# EAGLE design B163D (EAGLE 6.6.0)
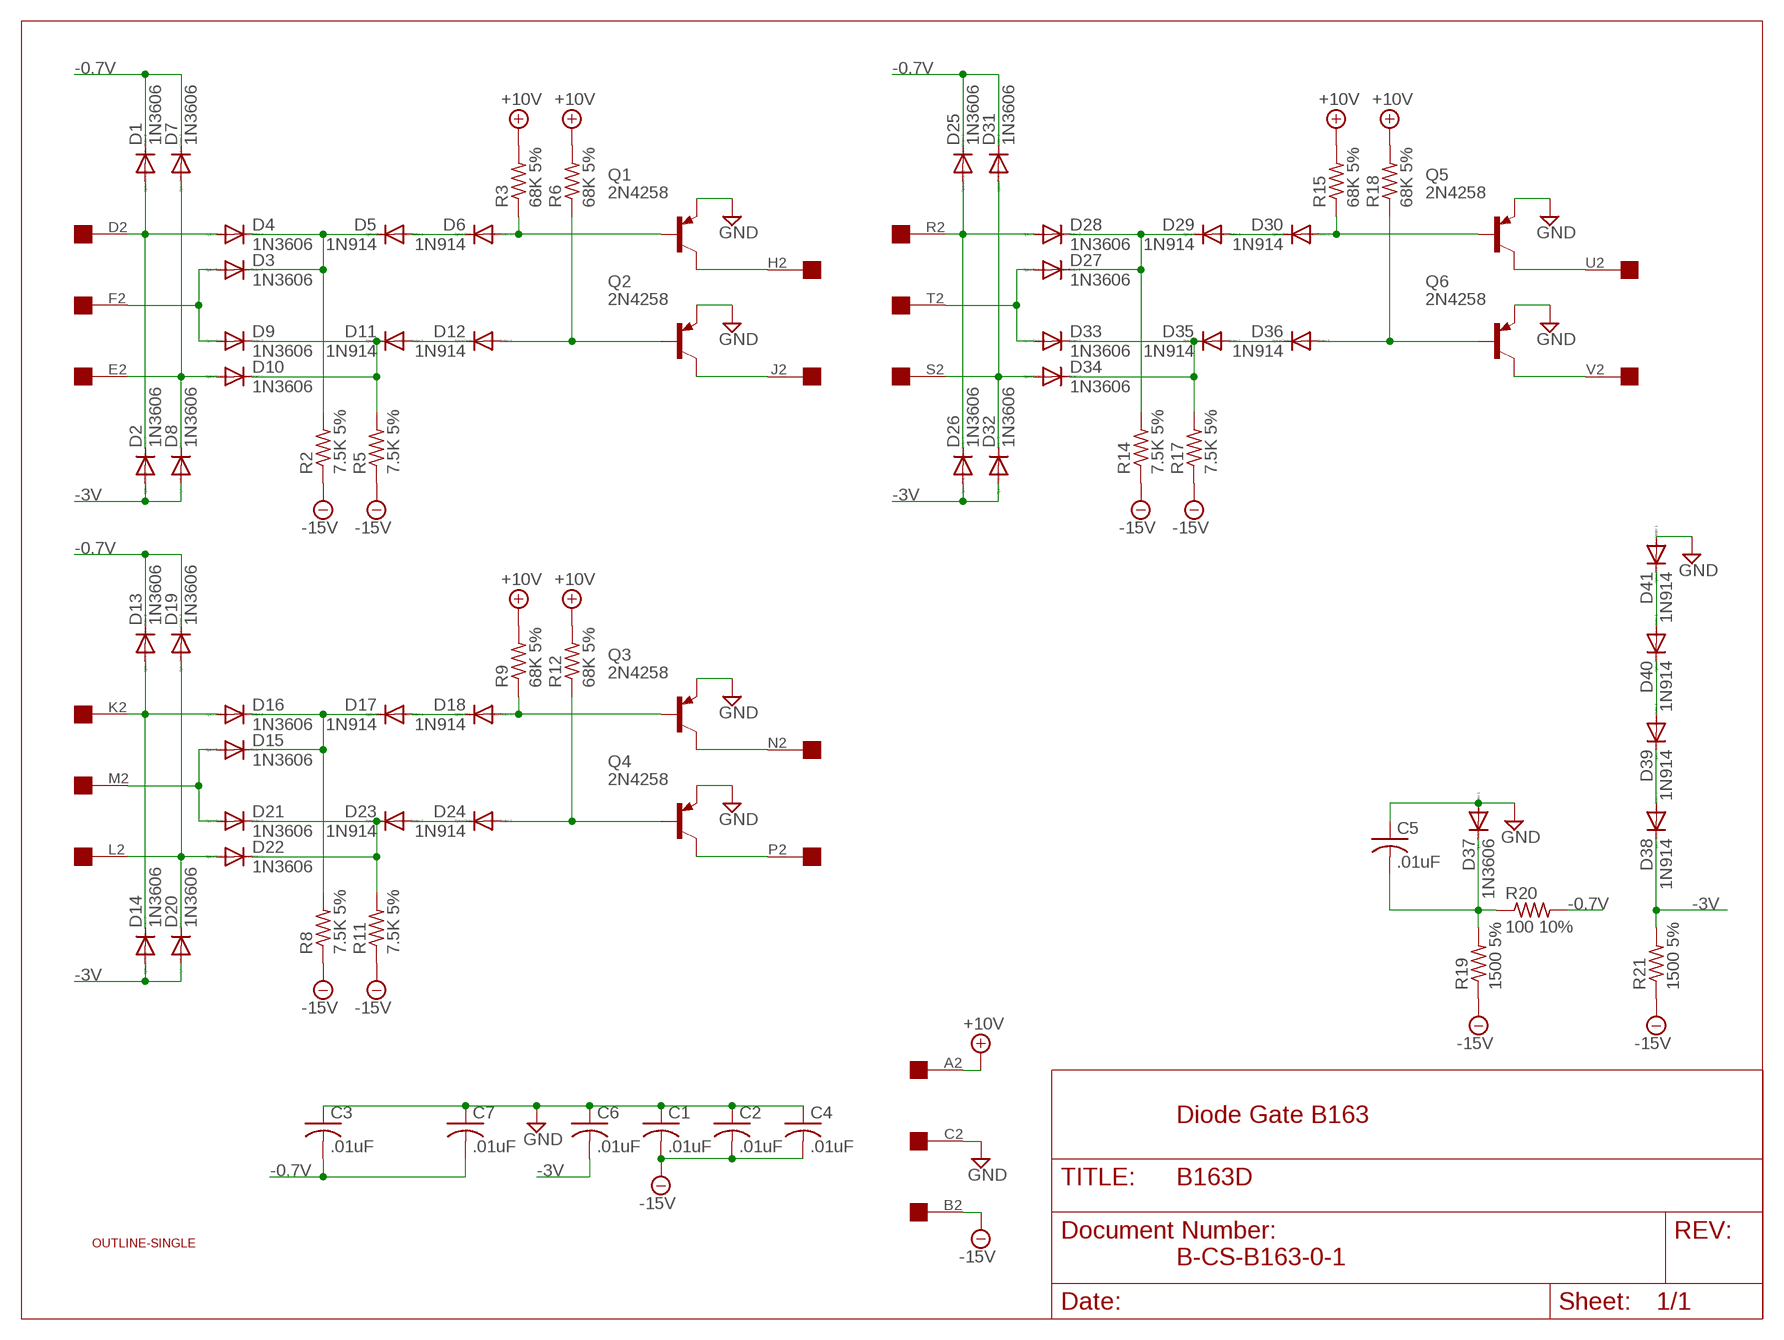
[diagram p0: schematic, sheet 1]

## Parts
C1  .01uF  C-US050-025X075  [C050-025X075]
C2  .01uF  C-US050-025X075  [C050-025X075]
C3  .01uF  C-US050-025X075  [C050-025X075]
C4  .01uF  C-US050-025X075  [C050-025X075]
C5  .01uF  C-US050-025X075  [C050-025X075]
C6  .01uF  C-US050-025X075  [C050-025X075]
C7  .01uF  C-US050-025X075  [C050-025X075]
D1  1N3606  1N4148DO35-10  [DO35-10]
D2  1N3606  1N4148DO35-10  [DO35-10]
D3  1N3606  1N4148DO35-10  [DO35-10]
D4  1N3606  1N4148DO35-10  [DO35-10]
D5  1N914  1N4148DO35-10  [DO35-10]
D6  1N914  1N4148DO35-10  [DO35-10]
D7  1N3606  1N4148DO35-10  [DO35-10]
D8  1N3606  1N4148DO35-10  [DO35-10]
D9  1N3606  1N4148DO35-10  [DO35-10]
D10  1N3606  1N4148DO35-10  [DO35-10]
D11  1N914  1N4148DO35-10  [DO35-10]
D12  1N914  1N4148DO35-10  [DO35-10]
D13  1N3606  1N4148DO35-10  [DO35-10]
D14  1N3606  1N4148DO35-10  [DO35-10]
D15  1N3606  1N4148DO35-10  [DO35-10]
D16  1N3606  1N4148DO35-10  [DO35-10]
D17  1N914  1N4148DO35-10  [DO35-10]
D18  1N914  1N4148DO35-10  [DO35-10]
D19  1N3606  1N4148DO35-10  [DO35-10]
D20  1N3606  1N4148DO35-10  [DO35-10]
D21  1N3606  1N4148DO35-10  [DO35-10]
D22  1N3606  1N4148DO35-10  [DO35-10]
D23  1N914  1N4148DO35-10  [DO35-10]
D24  1N914  1N4148DO35-10  [DO35-10]
D25  1N3606  1N4148DO35-10  [DO35-10]
D26  1N3606  1N4148DO35-10  [DO35-10]
D27  1N3606  1N4148DO35-10  [DO35-10]
D28  1N3606  1N4148DO35-10  [DO35-10]
D29  1N914  1N4148DO35-10  [DO35-10]
D30  1N914  1N4148DO35-10  [DO35-10]
D31  1N3606  1N4148DO35-10  [DO35-10]
D32  1N3606  1N4148DO35-10  [DO35-10]
D33  1N3606  1N4148DO35-10  [DO35-10]
D34  1N3606  1N4148DO35-10  [DO35-10]
D35  1N914  1N4148DO35-10  [DO35-10]
D36  1N914  1N4148DO35-10  [DO35-10]
D37  1N3606  1N4148DO35-10  [DO35-10]
D38  1N914  1N4148DO35-10  [DO35-10]
D39  1N914  1N4148DO35-10  [DO35-10]
D40  1N914  1N4148DO35-10  [DO35-10]
D41  1N914  1N4148DO35-10  [DO35-10]
Q1  2N4258  2N2904  [TO39]
Q2  2N4258  2N2904  [TO39]
Q3  2N4258  2N2904  [TO39]
Q4  2N4258  2N2904  [TO39]
Q5  2N4258  2N2904  [TO39]
Q6  2N4258  2N2904  [TO39]
R2  7.5K 5%  R-US_0207/10  [0207/10]
R3  68K 5%  R-US_0207/10  [0207/10]
R5  7.5K 5%  R-US_0207/10  [0207/10]
R6  68K 5%  R-US_0207/10  [0207/10]
R8  7.5K 5%  R-US_0207/10  [0207/10]
R9  68K 5%  R-US_0207/10  [0207/10]
R11  7.5K 5%  R-US_0207/10  [0207/10]
R12  68K 5%  R-US_0207/10  [0207/10]
R14  7.5K 5%  R-US_0207/10  [0207/10]
R15  68K 5%  R-US_0207/10  [0207/10]
R17  7.5K 5%  R-US_0207/10  [0207/10]
R18  68K 5%  R-US_0207/10  [0207/10]
R19  1500 5%  R-US_0207/10  [0207/10]
R20  100 10%  R-US_0207/10  [0207/10]
R21  1500 5%  R-US_0207/10  [0207/10]
U$1  OUTLINE-SINGLE  [SINGLE]
U$2  EDGE-1  [EDGE-CON1]

## Nets
+10V: R3.2 R6.2 R9.2 R12.2 R15.2 R18.2 U$2.A2
-0.7V: C3.2 C7.2 D1.C D7.C D13.C D19.C D25.C D31.C R20.2
-3V [Supply]: C6.2 D2.A D8.A D14.A D20.A D26.A D32.A D38.C R21.2
-15V: C1.2 C2.2 C4.2 R2.1 R5.1 R8.1 R11.1 R14.1 R17.1 R19.1 R21.1 U$2.B2
GND [Supply]: C1.1 C2.1 C3.1 C4.1 C5.1 C6.1 C7.1 D37.A D41.A Q1.1(E) Q2.1(E) Q3.1(E) Q4.1(E) Q5.1(E) Q6.1(E) U$2.C2
N$1: D7.A D8.C D10.A U$2.E2
N$2: D3.A D9.A U$2.F2
N$3: D6.A Q1.2(B) R3.1
N$4: D9.C D10.C D11.C R5.2
N$5: D3.C D4.C D5.C R2.2
N$6: D11.A D12.C
N$7: D12.A Q2.2(B) R6.1
N$8: Q2.3(C) U$2.J2
N$9: D15.C D16.C D17.C R8.2
N$10: D1.A D2.C D4.A U$2.D2
N$11: Q1.3(C) U$2.H2
N$12: D15.A D21.A U$2.M2
N$13: D13.A D14.C D16.A U$2.K2
N$14: D17.A D18.C
N$15: D5.A D6.C
N$16: D18.A Q3.2(B) R9.1
N$17: Q3.3(C) U$2.N2
N$18: D19.A D20.C D22.A U$2.L2
N$19: D21.C D22.C D23.C R11.2
N$20: D23.A D24.C
N$21: D24.A Q4.2(B) R12.1
N$22: Q4.3(C) U$2.P2
N$23: D27.C D28.C D29.C R14.2
N$24: D27.A D33.A U$2.T2
N$25: D25.A D26.C D28.A U$2.R2
N$26: D40.A D41.C
N$27: D39.A D40.C
N$28: D29.A D30.C
N$29: D38.A D39.C
N$30: D30.A Q5.2(B) R15.1
N$31: Q5.3(C) U$2.U2
N$32: D31.A D32.C D34.A U$2.S2
N$33: D33.C D34.C D35.C R17.2
N$34: D35.A D36.C
N$35: D36.A Q6.2(B) R18.1
N$36: Q6.3(C) U$2.V2
N$37: C5.2 D37.C R19.2 R20.1

## Notes on the sheet
- Diode Gate B163
- B-CS-B163-0-1

## Library data of the parts
C1-C7 = rcl:C-US: CAPACITOR, American symbol
D1-D41 = diode:1N4148: DIODE high speed (Philips)
Q1-Q6 = transistor-pnp:2N2904*: PNP Transistror
R2 R3 R5 R6 R8 R9 R11 R12 R14 R15 R17-R21 = rcl:R-US_: RESISTOR, American symbol
U$1 = dec-con:OUTLINE-*: Board outlines for DEC boards.
U$2 = dec-con:EDGE-1: Single-Sided DEC Edge Connector -- (side 2)

## Net classes
1 Supply: width 0.813 mm

## Board
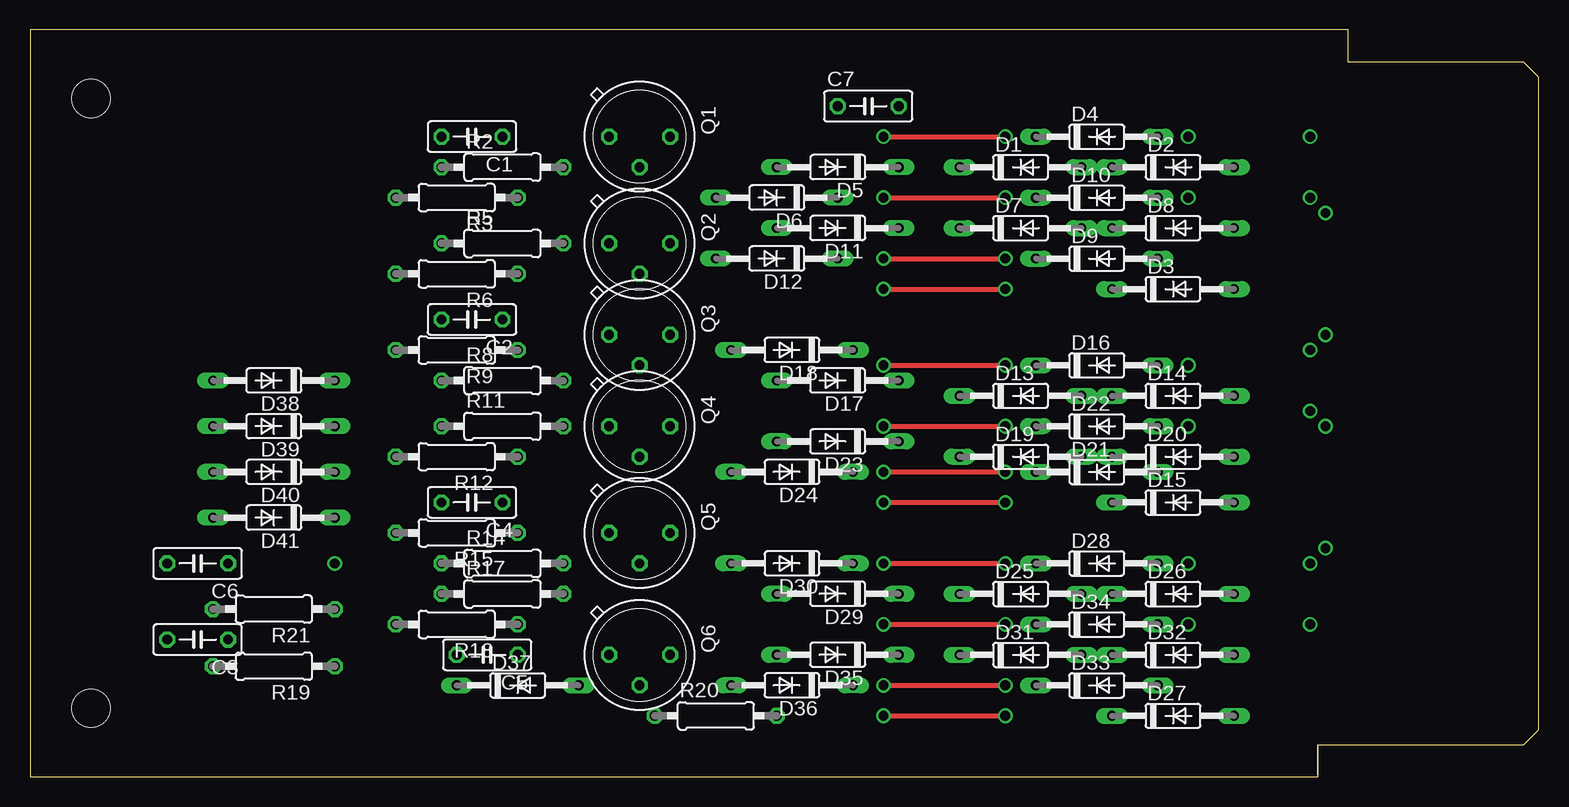
[diagram p1: board, top side]
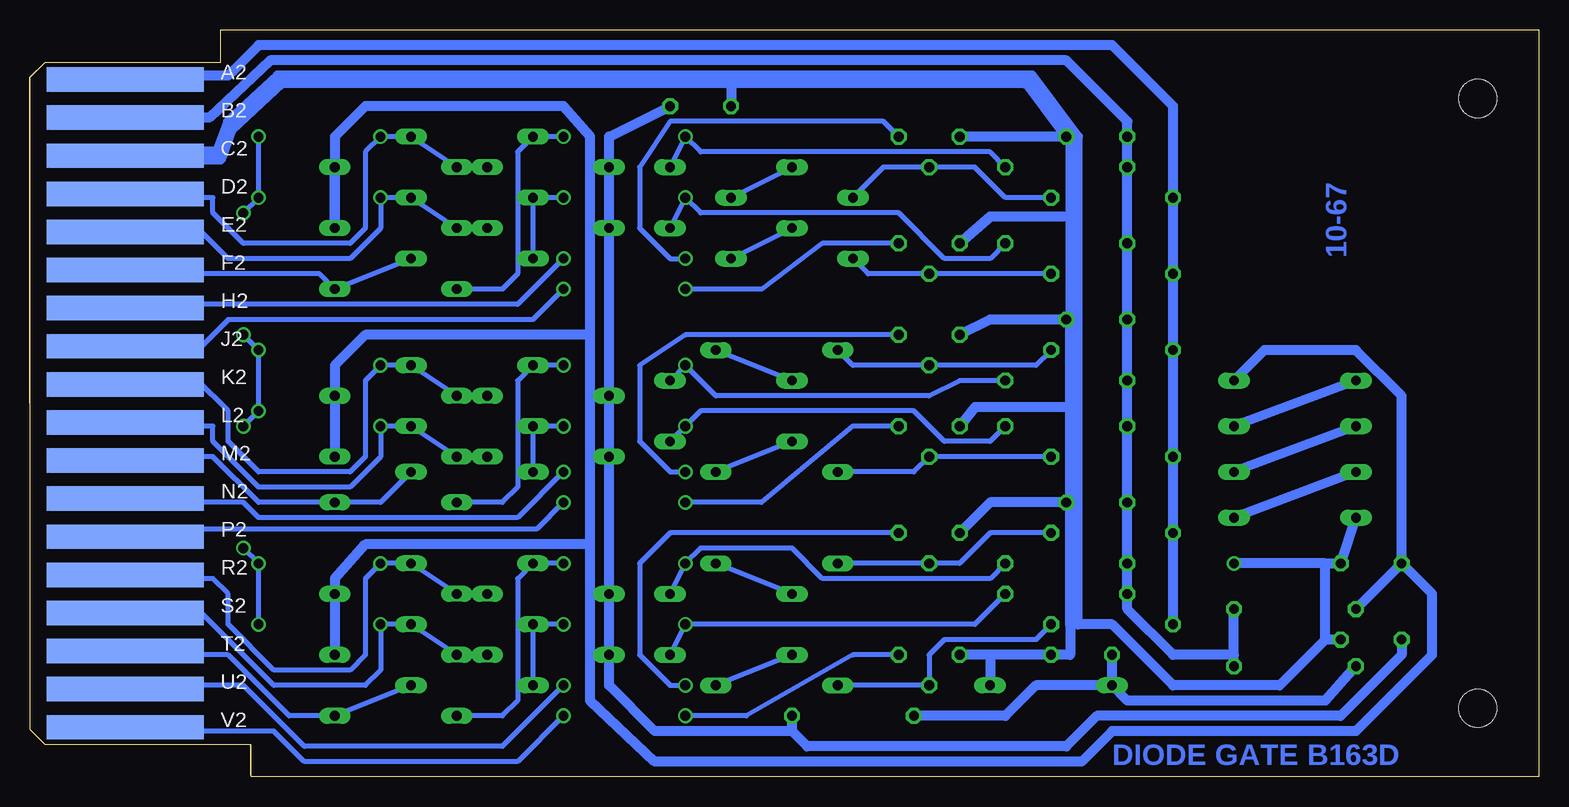
[diagram p2: board, bottom side, seen from below]

Size 125.73 x 62.23 mm. Coordinates in mm from the lower left corner, seen from the top.
Copper layers (1+16): Top 0.035mm / dielectric 1.5mm / Bottom 0.035mm
Design rules "16mils": minimum track width 16mil, minimum drill 32mil, track to track 15mil, track to pad 10mil, pad to pad 10mil, via to via 10mil, smd to smd 10mil, copper to edge 13mil, drill to drill 10mil, minimum pad ring 10mil, minimum via ring 8mil, stop-mask expansion 0mil, vias tented up to drill 0mil, thermal gap 10mil

### Footprints (pad centres in the part's own frame; a part is rotated, then mirrored left to right if it is on the bottom)
C050-025X075 = drill 0.813 octagon: 1 -2.54,0; 2 2.54,0
DO35-10 = drill 0.813 long: A 5.08,0; C -5.08,0
TO39 = drill 0.813 octagon: 1 0,-2.54; 2 2.54,0; 3 0,2.54
0207/10 = drill 0.813 octagon: 1 -5.08,0; 2 5.08,0
SINGLE = hole 3.175: 120.65,56.515; 120.65,5.715
EDGE-CON1 = smd 13.106 x 2.032 bottom: A2 7.938,4.128; B2 7.938,7.303; C2 7.938,10.477; D2 7.938,13.652; E2 7.938,16.828; F2 7.938,20.003; H2 7.938,23.177; J2 7.938,26.352; K2 7.938,29.527; L2 7.938,32.703; M2 7.938,35.877; N2 7.938,39.053; P2 7.938,42.227; R2 7.938,45.403; S2 7.938,48.578; T2 7.938,51.752; U2 7.938,54.928; V2 7.938,58.102

### Placement (x,y rotation side)
C1  36.83,53.34 180 top
C2  36.83,38.1 180 top
C3  13.97,11.43 180 top
C4  36.83,22.86 180 top
C5  38.1,10.16 180 top
C6  13.97,17.78 180 top
C7  69.85,55.88 0 top
D1  82.55,50.8 0 top
D2  95.25,50.8 0 top
D3  95.25,40.64 0 top
D4  88.9,53.34 0 top
D5  67.31,50.8 180 top
D6  62.23,48.26 180 top
D7  82.55,45.72 0 top
D8  95.25,45.72 0 top
D9  88.9,43.18 0 top
D10  88.9,48.26 0 top
D11  67.31,45.72 180 top
D12  62.23,43.18 180 top
D13  82.55,31.75 0 top
D14  95.25,31.75 0 top
D15  95.25,22.86 0 top
D16  88.9,34.29 0 top
D17  67.31,33.02 180 top
D18  63.5,35.56 180 top
D19  82.55,26.67 0 top
D20  95.25,26.67 0 top
D21  88.9,25.4 0 top
D22  88.9,29.21 0 top
D23  67.31,27.94 180 top
D24  63.5,25.4 180 top
D25  82.55,15.24 0 top
D26  95.25,15.24 0 top
D27  95.25,5.08 0 top
D28  88.9,17.78 0 top
D29  67.31,15.24 180 top
D30  63.5,17.78 180 top
D31  82.55,10.16 0 top
D32  95.25,10.16 0 top
D33  88.9,7.62 0 top
D34  88.9,12.7 0 top
D35  67.31,10.16 180 top
D36  63.5,7.62 180 top
D37  40.64,7.62 0 top
D38  20.32,33.02 180 top
D39  20.32,29.21 180 top
D40  20.32,25.4 180 top
D41  20.32,21.59 180 top
Q1  50.8,53.34 270 top
Q2  50.8,44.45 270 top
Q3  50.8,36.83 270 top
Q4  50.8,29.21 270 top
Q5  50.8,20.32 270 top
Q6  50.8,10.16 270 top
R2  39.37,50.8 0 top
R3  35.56,48.26 180 top
R5  39.37,44.45 0 top
R6  35.56,41.91 180 top
R8  39.37,33.02 0 top
R9  35.56,35.56 180 top
R11  39.37,29.21 0 top
R12  35.56,26.67 180 top
R14  39.37,17.78 0 top
R15  35.56,20.32 180 top
R17  39.37,15.24 0 top
R18  35.56,12.7 180 top
R19  20.32,9.21 180 top
R20  57.15,5.08 0 top
R21  20.32,13.97 180 top
U$1  125.73,62.23 180 top
U$2  125.73,62.23 180 top

### Tracks (layer width: path | path; a pad name or v marks a point on that pad's centre or on a via)
+10V
  Bottom 0.813: U$2.A2 116.84,58.42 109.22,58.42 106.68,60.96 35.56,60.96 30.48,55.88 R3.2 R6.2 R9.2 R12.2 R15.2 R18.2
-0.7V
  Bottom 0.813: C7.2 77.47,53.34 D1.C D7.C D13.C D19.C D25.C D31.C 77.47,7.62 73.66,3.81 62.23,3.81 | C3.2 11.43,10.16 16.51,5.08 36.83,5.08 39.37,2.54 60.96,2.54 62.23,3.81 | 62.23,3.81 R20.2
-3V
  Bottom 0.813: D38.C 22.86,35.56 15.24,35.56 11.43,31.75 C6.2 | C6.2 R21.2 | C6.2 8.89,15.24 8.89,10.16 15.24,3.81 35.56,3.81 38.1,1.27 73.66,1.27 79.06,6.35 79.06,19.37 | D2.A D8.A 100.33,53.34 97.79,55.88 81.28,55.88 79.06,53.34 79.06,36.83 | 79.06,36.83 97.79,36.83 100.33,34.29 D14.A D20.A | D32.A D26.A 100.33,16.51 97.79,19.37 79.06,19.37 | 79.06,19.37 79.06,36.83
-15V
  Bottom 0.813: U$2.B2 117.16,54.93 110.81,54.93 105.73,59.69 39.37,59.69 34.29,54.61 C1.2 R2.1 R5.1 C2.2 R8.1 R11.1 C4.2 R14.1 R17.1 34.29,13.97 30.48,10.16 25.4,10.16 | R19.1 25.4,10.16 | 25.4,10.16 R21.1
GND  (via drill 0.81)
  Bottom 0.813: U$2.C2 116.84,52.07 110.17,52.07 | 109.86,51.44 110.17,52.07 | 104.78,57.78 104.14,58.42 | 104.78,57.78 108.9,53.98 109.86,51.44 | 43.18,58.42 67.31,58.42 | 67.31,58.42 104.14,58.42 | 43.18,58.42 C1.1 | C1.1 Q1.1 | 67.31,58.42 C7.1 | C2.1 39.05,38.42 39.05,46.67 | 39.05,46.67 39.05,53.34 C1.1 | C4.1 39.05,23.18 39.05,30.8 | 39.05,30.8 39.05,38.1 C2.1 | 39.05,12.7 39.05,10.16 C5.1 45.72,10.16 | 39.05,12.7 39.05,22.86 C4.1 | 45.72,10.16 D37.A | Q5.1 45.72,22.86 C4.1 | Q4.1 46.99,30.8 39.05,30.8 | Q3.1 45.72,38.1 C2.1 | Q2.1 45.72,46.67 39.05,46.67 | D41.A C6.1 17.78,17.78 | 17.78,17.78 v25.4,17.78 | C3.1 17.78,11.43 | 17.78,11.43 17.78,17.78 | 45.72,10.16 Q6.1 | 38.42,12.7 35.56,12.7 30.48,7.62 21.59,7.62 17.78,11.43 | 38.42,12.7 39.05,12.7 | 43.18,58.42 42.23,58.42 38.42,53.34 38.42,12.7 | 43.18,58.42 42.86,57.78 104.78,57.78 | 104.14,58.42 105.09,58.42 109.22,54.61 110.17,52.07 | 118.11,52.07 116.84,51.44 109.86,51.44
N$1  (via drill 0.81)
  Bottom 0.406: D7.A D8.C D10.A v96.52,48.26 96.52,45.72 99.06,43.18 109.22,43.18 111.76,45.72 116.84,45.72 U$2.E2
N$2
  Bottom 0.406: U$2.F2 116.84,41.91 101.6,41.91 D3.A D9.A
N$3
  Bottom 0.406: D6.A 54.61,50.8 Q1.2 46.99,50.8 44.45,48.26 R3.1
N$4  (via drill 0.81)
  Top 0.406: v71.12,48.26 v81.28,48.26
  Bottom 0.406: D11.C v71.12,48.26 69.85,46.99 53.34,46.99 49.53,43.18 45.72,43.18 R5.2 | v81.28,48.26 D10.C D9.C
N$5  (via drill 0.81)
  Top 0.406: v71.12,53.34 v81.28,53.34
  Bottom 0.406: R2.2 45.72,52.07 69.85,52.07 v71.12,53.34 D5.C | v81.28,53.34 D4.C 85.09,52.07 85.09,41.91 86.36,40.64 D3.C
N$6
  Bottom 0.406: D11.A D12.C
N$7
  Bottom 0.406: R6.1 Q2.2 55.88,41.91 D12.A
N$8  (via drill 0.81)
  Top 0.406: v71.12,40.64 v81.28,40.64
  Bottom 0.406: Q2.3 59.69,44.45 64.77,40.64 v71.12,40.64 | U$2.J2 116.84,35.56 111.76,35.56 109.22,38.1 83.82,38.1 v81.28,40.64
N$9  (via drill 0.81)
  Top 0.406: v71.12,34.29 v81.28,34.29
  Bottom 0.406: D17.C v71.12,34.29 68.58,31.75 50.8,31.75 48.26,33.02 R8.2 | v81.28,34.29 D16.C 85.09,33.02 85.09,24.13 86.36,22.86 D15.C
N$10  (via drill 0.81)
  Bottom 0.406: D1.A D2.C D4.A v96.52,53.34 97.79,52.07 97.79,45.72 99.06,44.45 107.95,44.45 110.49,46.99 110.49,48.26 116.84,48.26 U$2.D2
N$11  (via drill 0.81)
  Top 0.406: v71.12,43.18 v81.28,43.18
  Bottom 0.406: Q1.3 54.61,54.61 72.39,54.61 74.93,50.8 74.93,45.72 72.39,43.18 v71.12,43.18 | U$2.H2 116.84,39.37 85.09,39.37 v81.28,43.18
N$12
  Bottom 0.406: D21.A 96.52,22.86 D15.A 106.68,22.86 110.49,26.67 116.84,26.67 U$2.M2
N$13  (via drill 0.81)
  Bottom 0.406: D13.A D14.C D16.A v96.52,34.29 97.79,33.02 97.79,26.67 99.06,25.4 106.68,25.4 109.22,27.94 109.22,30.48 111.76,33.02 116.84,33.02 U$2.K2
N$14
  Bottom 0.406: D17.A D18.C
N$15
  Bottom 0.406: D5.A D6.C
N$16
  Bottom 0.406: R9.1 41.91,34.29 Q3.2 57.15,34.29 D18.A
N$17  (via drill 0.81)
  Top 0.406: v71.12,25.4 v81.28,25.4
  Bottom 0.406: Q3.3 71.12,36.83 74.93,34.29 74.93,27.94 72.39,25.4 v71.12,25.4 | v81.28,25.4 85.09,21.59 106.68,21.59 107.95,22.86 116.84,22.86 U$2.N2
N$18  (via drill 0.81)
  Bottom 0.406: D19.A D20.C D22.A v96.52,29.21 96.52,26.67 99.06,24.13 106.68,24.13 110.49,27.94 110.49,29.21 111.76,29.21 116.84,29.21 U$2.L2
N$19  (via drill 0.81)
  Top 0.406: v71.12,29.21 v81.28,29.21
  Bottom 0.406: D23.C v71.12,29.21 69.85,30.48 52.07,30.48 49.53,27.94 45.72,27.94 R11.2 | v81.28,29.21 D22.C D21.C
N$20
  Bottom 0.406: D23.A D24.C
N$21
  Bottom 0.406: R12.1 Q4.2 52.07,25.4 D24.A
N$22  (via drill 0.81)
  Top 0.406: v71.12,22.86 v81.28,22.86
  Bottom 0.406: Q4.3 57.15,29.21 64.77,22.86 v71.12,22.86 | v81.28,22.86 83.5,20.64 111.76,20.64 116.84,20.32 U$2.P2
N$23  (via drill 0.81)
  Top 0.406: v71.12,17.78 v81.28,17.78
  Bottom 0.406: D29.C v71.12,17.78 69.85,19.05 62.23,19.05 59.69,16.51 45.72,16.51 R14.2 | v81.28,17.78 D28.C 85.09,16.51 85.09,6.35 86.36,5.08 D27.C
N$24
  Bottom 0.406: U$2.T2 117.17,10.49 116.84,10.16 109.22,10.16 104.14,5.08 D27.A D33.A
N$25  (via drill 0.81)
  Bottom 0.406: U$2.R2 117.17,16.84 116.84,16.51 110.49,16.51 109.22,15.24 109.22,12.7 105.41,8.89 99.06,8.89 97.79,10.16 97.79,16.51 v96.52,17.78 D28.A D26.C D25.A
N$26
  Bottom 0.813: D40.A D41.C
N$27
  Bottom 0.813: D39.A D40.C
N$28
  Bottom 0.406: D29.A D30.C
N$29
  Bottom 0.813: D38.A D39.C
N$30
  Bottom 0.406: R15.1 45.72,20.32 48.26,17.78 Q5.2 D30.A
N$31  (via drill 0.81)
  Top 0.406: v71.12,7.62 v81.28,7.62
  Bottom 0.406: U$2.U2 116.84,7.26 116.84,7.62 107.95,7.62 102.87,2.54 86.36,2.54 v81.28,7.62 | Q5.3 72.39,20.32 74.93,17.78 74.93,10.16 72.39,7.62 v71.12,7.62
N$32  (via drill 0.81)
  Bottom 0.406: U$2.S2 117.14,13.66 116.84,13.97 111.76,13.97 105.41,7.62 97.79,7.62 96.52,8.89 v96.52,12.7 D34.A D32.C D31.A
N$33  (via drill 0.81)
  Top 0.406: v71.12,12.7 v81.28,12.7
  Bottom 0.406: D35.C v71.12,12.7 46.99,12.7 R17.2 | v81.28,12.7 D34.C D33.C
N$34
  Bottom 0.406: D35.A D36.C
N$35
  Bottom 0.406: R18.1 41.91,11.43 49.53,11.43 50.8,10.16 Q6.2 D36.A
N$36  (via drill 0.81)
  Top 0.406: v71.12,5.08 v81.28,5.08
  Bottom 0.406: U$2.V2 116.84,4.13 116.84,3.81 105.41,3.81 102.87,1.27 85.09,1.27 v81.28,5.08 | Q6.3 57.15,10.16 66.04,5.08 v71.12,5.08
N$37
  Bottom 0.813: R20.1 44.45,5.08 41.91,7.62 D37.C | R19.2 17.78,6.35 34.29,6.35 D37.C | D37.C C5.2
N$38  (via drill 0.81)
  Bottom 0.406: v106.68,12.7 v106.68,17.78 v107.95,19.05
N$39  (via drill 0.81)
  Bottom 0.406: v107.95,36.83 v106.68,35.56 v106.68,30.48 v107.95,29.21
N$40  (via drill 0.81)
  Bottom 0.406: v107.95,46.99 v106.68,48.26 v106.68,53.34

### Text on the board
Bottom: 10-67 | DIODE GATE B163D